# Altium schematic sheet SARADC.SchDoc: SARADC
size A4; DrawnBy: ThanhQuoc; Revision: V01; SheetNumber: 14; SheetTotal: 21; Project: RV1126 CAMERA BOARD DESIGN; SPICEModelCacheTSUQRNIG: <root> / <DocumentId>TSUQRNIG</DocumentId> / <CacheFrame Number="0"> / <Model Name="fb_220_adv" Kind="CKT"> / <Text>.SUBCKT FB_220_ADV 1 2 / Rdc 1 2 0.045 / * low freq inductive / L1 1 3 50n / R1 3 2 1 / * high freq loss / R2 1 2 200 / Cpar 1 2 2p / .ends FB_220_ADV</Text> / </Model> / </CacheFrame> / </root>
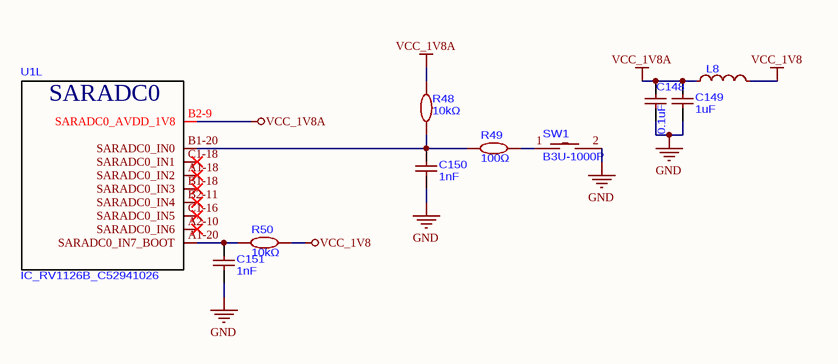
[diagram p0: SARADC.SchDoc]

## Parts
C148  0.1uF  [C0201]
C149  1uF  [C0201]
C150  1nF  [C0201]
C151  1nF  [C0201]
L8  FERRITE BEAD 120Ω 0201 1LN  [R0201]  (value not drawn)
R48  10kΩ  [R0201]
R49  100Ω  [R0201]
R50  10kΩ  [R0201]
SW1  B3U-1000P  [KEY-SMD_B3U-1000PM]
U1  IC_RV1126B_C52941026  [CCSP-491_L14.0-W14.0-TL_RV1126B]  (part L of 18)

## Nets
GND: C148.1 C149.2 C150.1 C151.1 SW1.2
VCC_1V8: L8.2 R50.1
VCC_1V8A: C148.2 C149.1 L8.1 R48.2 U1.B2-9(SARADC0_AVDD_1V8)
NetC150_2: C150.2 R48.1 R49.1 U1.B1-20(SARADC0_IN0)
NetC151_2: C151.2 R50.2 U1.A1-20(SARADC0_IN7_BOOT)
NetR49_2: R49.2 SW1.1

Not connected (* = marked no-connect by the designer): U1 A1-18(SARADC0_IN2)* A2-10(SARADC0_IN6)* B1-18(SARADC0_IN3)* B2-11(SARADC0_IN4)* C1-16(SARADC0_IN5)* C1-18(SARADC0_IN1)*

## Notes on the sheet
- Title:
- Drawn By:
- Page Contents:
- Checked By:
- Size:
- Date:
- File:
- License:
- Email:
- A4
- nguyenthanhquoc0206@gmail.com
- Number:
- Time:
- Revision:
- Sheet
- Website:
- of
- https://www.facebook.com/ntq.687
- (in symbol IC_RV1126B_C52941026, part L) SARADC0

## Library data of the parts
C148 = CAP_100nF-6.3V-10%-0201_1: 0.1uF ±10% 6.3V Ceramic Capacitor X5R 0201
C149 = CAP_1uF-6.3V-10%-0201: 1uF ±10% 6.3V Ceramic Capacitor X5R 0201
C150 C151 = CAP_1nF-50V-10%-0201: CAP CER 1nF 50V X7R 0201
L8 = MPZ0603S121HT000: 120 Ohms @ 100MHz 1 Power Line Ferrite Bead 0201 1A 130mOhm
R48 R50 = RES_10K-50mW-1%-0201: RES 10KΩ ±1% 50mW 0201; ComponentLink1Description: LCSC; ComponentLink1URL: https://www.lcsc.com/product-detail/C93949.html?spm=wm.fly.bg.0.xh&lcsc_vid=EwRWBFZSQVIPVFdUTlJfVldeFFRYUFQAElRYBFRRE1MxVlNeRVlXUFNQQ1RWXjsOAxUeFF5JWBYZEEoKFBINSQcJGk4eFQsCAgIaSgADAwAHC0slRlVYUFFIHxUDCw%3D%3D
R49 = RES_100OHM-50mW-1%-0201: RES 100Ω ±1% 50mW 0201
SW1 = B3U-1000P: 12V 2.5mm Round Button 3mm SPST 50mA SMD,3x2.5mm Tactile Switches ROHS